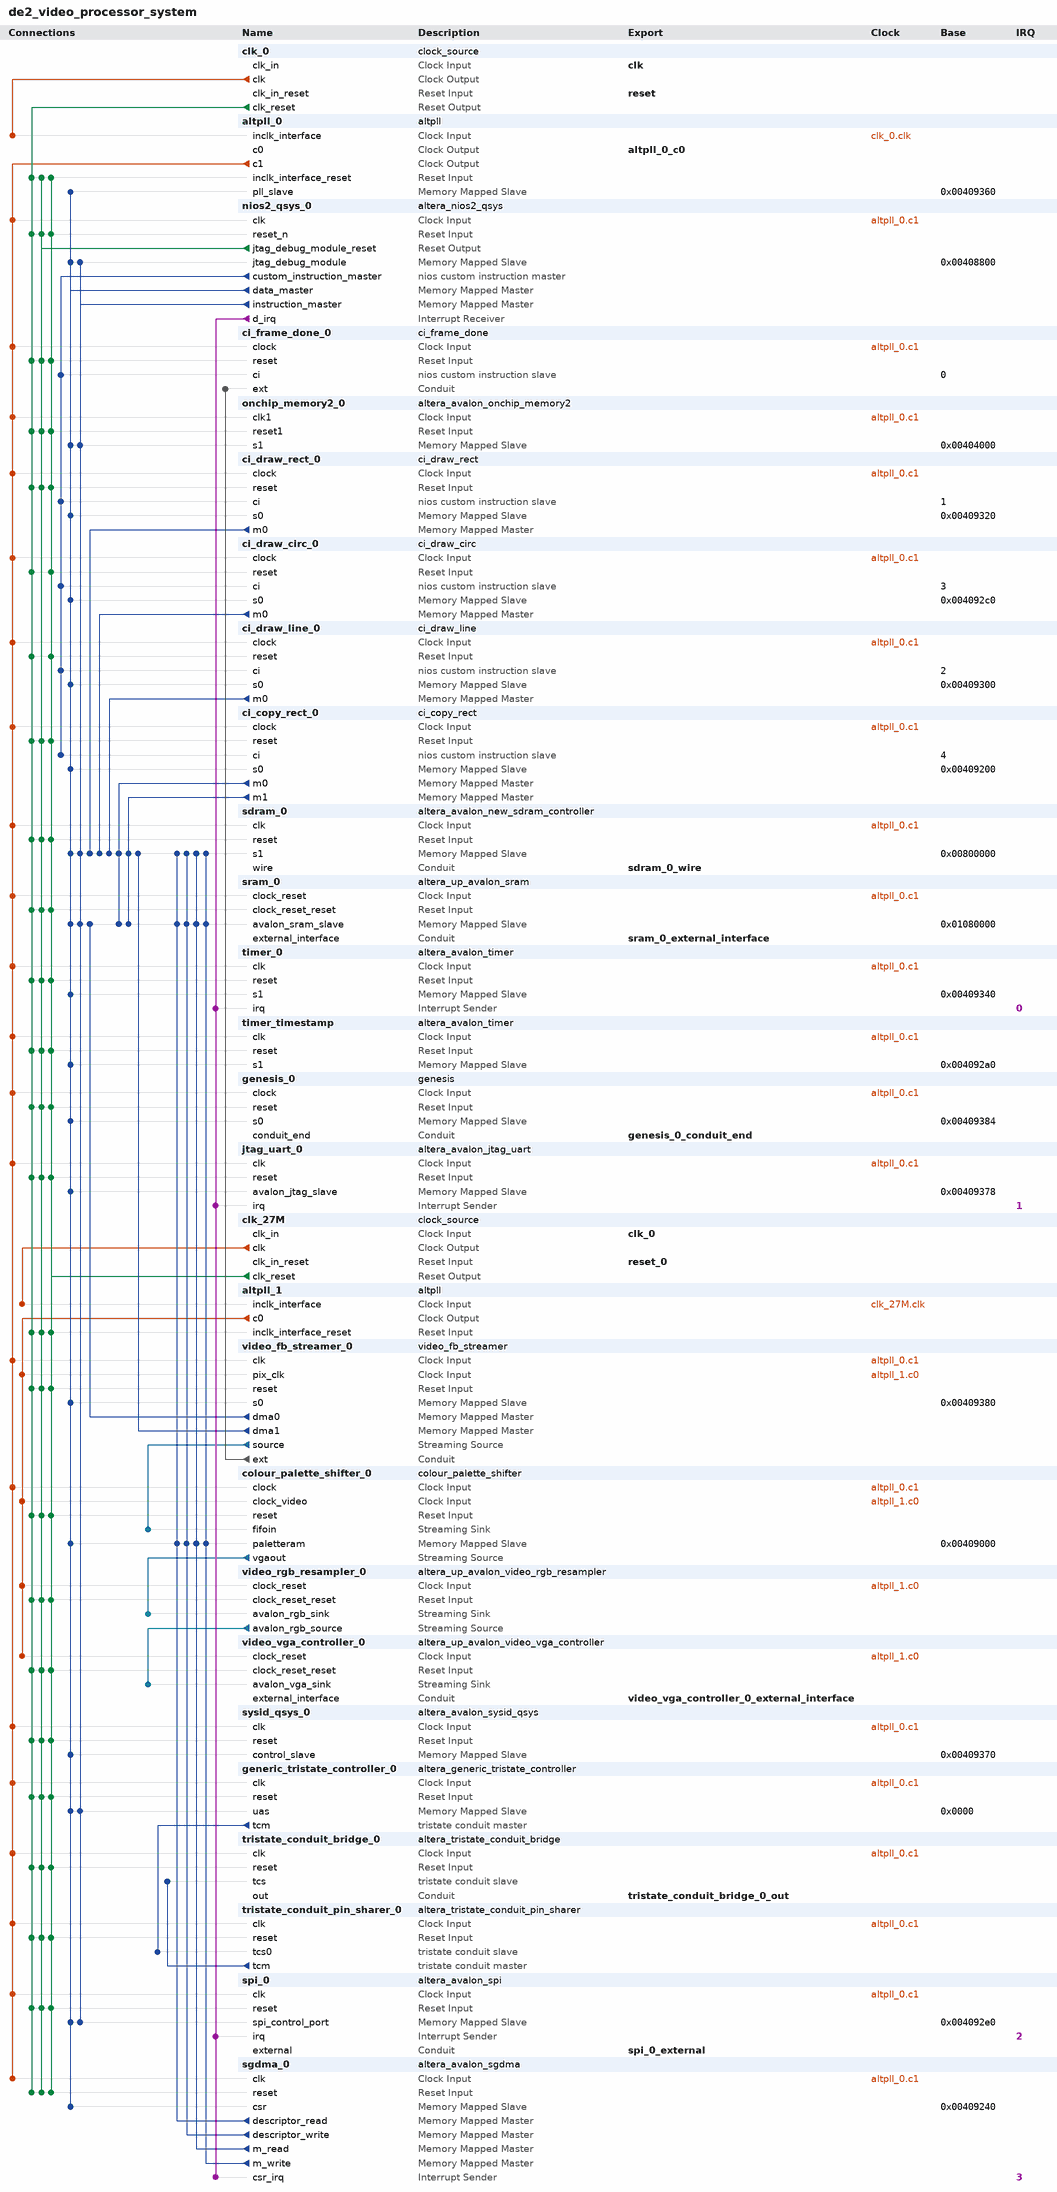
[diagram p0: system contents]
# Platform Designer (Qsys) system de2_video_processor_system, Cyclone II EP2C35F672C6
# Parameters at their usual value, and those the tool derives, are not listed.
package require -exact qsys 12.1
create_system de2_video_processor_system
set_project_property DEVICE_FAMILY {Cyclone II}
set_project_property DEVICE EP2C35F672C6

add_instance clk_0 clock_source 12.1
set_instance_parameter_value clk_0 clockFrequency 50000000

add_instance altpll_0 altpll 12.1
set_instance_parameter_value altpll_0 INCLK0_INPUT_FREQUENCY 20000
set_instance_parameter_value altpll_0 GATE_LOCK_SIGNAL NO
set_instance_parameter_value altpll_0 VALID_LOCK_MULTIPLIER 1
set_instance_parameter_value altpll_0 INVALID_LOCK_MULTIPLIER 5
set_instance_parameter_value altpll_0 CLK0_MULTIPLY_BY 3
set_instance_parameter_value altpll_0 CLK1_MULTIPLY_BY 3
set_instance_parameter_value altpll_0 CLK2_MULTIPLY_BY 1
set_instance_parameter_value altpll_0 CLK0_DIVIDE_BY 2
set_instance_parameter_value altpll_0 CLK1_DIVIDE_BY 2
set_instance_parameter_value altpll_0 CLK2_DIVIDE_BY 2
set_instance_parameter_value altpll_0 CLK0_PHASE_SHIFT -3000
set_instance_parameter_value altpll_0 CLK1_PHASE_SHIFT 0
set_instance_parameter_value altpll_0 CLK2_PHASE_SHIFT 0
set_instance_parameter_value altpll_0 CLK1_DUTY_CYCLE 50
set_instance_parameter_value altpll_0 CLK2_DUTY_CYCLE 50
set_instance_parameter_value altpll_0 PORT_clk1 PORT_USED
set_instance_parameter_value altpll_0 PORT_clk2 PORT_USED
set_instance_parameter_value altpll_0 PORT_clk3 PORT_UNUSED
set_instance_parameter_value altpll_0 PORT_ARESET PORT_UNUSED
set_instance_parameter_value altpll_0 PORT_LOCKED PORT_UNUSED

add_instance nios2_qsys_0 altera_nios2_qsys 12.1
set_instance_parameter_value nios2_qsys_0 muldiv_divider true
set_instance_parameter_value nios2_qsys_0 resetSlave generic_tristate_controller_0.uas
set_instance_parameter_value nios2_qsys_0 exceptionSlave onchip_memory2_0.s1
set_instance_parameter_value nios2_qsys_0 breakSlave nios2_qsys_0.jtag_debug_module
set_instance_parameter_value nios2_qsys_0 impl Small
set_instance_parameter_value nios2_qsys_0 icache_size 1024
set_instance_parameter_value nios2_qsys_0 icache_burstType Sequential

add_instance ci_frame_done_0 ci_frame_done 1.0

add_instance onchip_memory2_0 altera_avalon_onchip_memory2 12.1
set_instance_parameter_value onchip_memory2_0 dataWidth 32
set_instance_parameter_value onchip_memory2_0 dualPort false
set_instance_parameter_value onchip_memory2_0 initMemContent true
set_instance_parameter_value onchip_memory2_0 initializationFileName onchip_memory2_0
set_instance_parameter_value onchip_memory2_0 memorySize 16384

add_instance ci_draw_rect_0 ci_draw_rect 1.0

add_instance ci_draw_circ_0 ci_draw_circ 1.0

add_instance ci_draw_line_0 ci_draw_line 1.0

add_instance ci_copy_rect_0 ci_copy_rect 1.0

add_instance sdram_0 altera_avalon_new_sdram_controller 12.1
set_instance_parameter_value sdram_0 TAC 5.5
set_instance_parameter_value sdram_0 TRCD 20.0
set_instance_parameter_value sdram_0 TRP 20.0
set_instance_parameter_value sdram_0 casLatency 3
set_instance_parameter_value sdram_0 columnWidth 8
set_instance_parameter_value sdram_0 dataWidth 16
set_instance_parameter_value sdram_0 generateSimulationModel false
set_instance_parameter_value sdram_0 model custom
set_instance_parameter_value sdram_0 numberOfBanks 4
set_instance_parameter_value sdram_0 numberOfChipSelects 1
set_instance_parameter_value sdram_0 powerUpDelay 100.0
set_instance_parameter_value sdram_0 refreshPeriod 15.625
set_instance_parameter_value sdram_0 rowWidth 12

add_instance sram_0 altera_up_avalon_sram 12.0
set_instance_parameter_value sram_0 board DE2
set_instance_parameter_value sram_0 pixel_buffer false

add_instance timer_0 altera_avalon_timer 12.1
set_instance_parameter_value timer_0 period 1
set_instance_parameter_value timer_0 periodUnits MSEC
set_instance_parameter_value timer_0 timerPreset CUSTOM

add_instance timer_timestamp altera_avalon_timer 12.1
set_instance_parameter_value timer_timestamp period 1
set_instance_parameter_value timer_timestamp periodUnits MSEC
set_instance_parameter_value timer_timestamp timerPreset CUSTOM

add_instance genesis_0 genesis 1.0

add_instance jtag_uart_0 altera_avalon_jtag_uart 12.1
set_instance_parameter_value jtag_uart_0 simInteractiveOptions INTERACTIVE_INPUT_OUTPUT

add_instance clk_27M clock_source 12.1
set_instance_parameter_value clk_27M clockFrequency 27000000

add_instance altpll_1 altpll 12.1
set_instance_parameter_value altpll_1 INCLK0_INPUT_FREQUENCY 37037
set_instance_parameter_value altpll_1 GATE_LOCK_SIGNAL NO
set_instance_parameter_value altpll_1 VALID_LOCK_MULTIPLIER 1
set_instance_parameter_value altpll_1 INVALID_LOCK_MULTIPLIER 5
set_instance_parameter_value altpll_1 CLK0_MULTIPLY_BY 1007
set_instance_parameter_value altpll_1 CLK0_DIVIDE_BY 1080
set_instance_parameter_value altpll_1 PORT_clk1 PORT_UNUSED
set_instance_parameter_value altpll_1 PORT_clk2 PORT_UNUSED
set_instance_parameter_value altpll_1 PORT_clk3 PORT_UNUSED
set_instance_parameter_value altpll_1 PORT_ARESET PORT_USED
set_instance_parameter_value altpll_1 PORT_LOCKED PORT_USED

add_instance video_fb_streamer_0 video_fb_streamer 1.0
set_instance_parameter_value video_fb_streamer_0 SRAM_BUF_START_ADDRESS 17301504
set_instance_parameter_value video_fb_streamer_0 BITS_PER_PIXEL 8
set_instance_parameter_value video_fb_streamer_0 FRAME_WIDTH 640
set_instance_parameter_value video_fb_streamer_0 FRAME_HEIGHT 480

add_instance colour_palette_shifter_0 colour_palette_shifter 1.0
set_instance_parameter_value colour_palette_shifter_0 VGA_INPUT_STREAM_WIDTH 8
set_instance_parameter_value colour_palette_shifter_0 VGA_OUTPUT_STREAM_WIDTH 16

add_instance video_rgb_resampler_0 altera_up_avalon_video_rgb_resampler 12.0
set_instance_parameter_value video_rgb_resampler_0 input_type {16-bit RGB}
set_instance_parameter_value video_rgb_resampler_0 output_type {30-bit RGB}
set_instance_parameter_value video_rgb_resampler_0 alpha 1023

add_instance video_vga_controller_0 altera_up_avalon_video_vga_controller 12.0
set_instance_parameter_value video_vga_controller_0 board DE2

add_instance sysid_qsys_0 altera_avalon_sysid_qsys 12.1
set_instance_parameter_value sysid_qsys_0 id 1335541401

add_instance generic_tristate_controller_0 altera_generic_tristate_controller 12.1
set_instance_parameter_value generic_tristate_controller_0 TCM_ADDRESS_W 22
set_instance_parameter_value generic_tristate_controller_0 TCM_DATA_W 8
set_instance_parameter_value generic_tristate_controller_0 TCM_BYTEENABLE_W 1
set_instance_parameter_value generic_tristate_controller_0 TCM_READ_WAIT 160
set_instance_parameter_value generic_tristate_controller_0 TCM_WRITE_WAIT 160
set_instance_parameter_value generic_tristate_controller_0 TCM_SETUP_WAIT 40
set_instance_parameter_value generic_tristate_controller_0 TCM_DATA_HOLD 40
set_instance_parameter_value generic_tristate_controller_0 TCM_MAX_PENDING_READ_TRANSACTIONS 3
set_instance_parameter_value generic_tristate_controller_0 TCM_TURNAROUND_TIME 2
set_instance_parameter_value generic_tristate_controller_0 TCM_TIMING_UNITS 0
set_instance_parameter_value generic_tristate_controller_0 TCM_READLATENCY 2
set_instance_parameter_value generic_tristate_controller_0 TCM_SYMBOLS_PER_WORD 1
set_instance_parameter_value generic_tristate_controller_0 USE_READ 1
set_instance_parameter_value generic_tristate_controller_0 USE_BEGINTRANSFER 0
set_instance_parameter_value generic_tristate_controller_0 USE_BYTEENABLE 0
set_instance_parameter_value generic_tristate_controller_0 USE_OUTPUTENABLE 0
set_instance_parameter_value generic_tristate_controller_0 ACTIVE_LOW_READ 1
set_instance_parameter_value generic_tristate_controller_0 ACTIVE_LOW_BYTEENABLE 0
set_instance_parameter_value generic_tristate_controller_0 ACTIVE_LOW_OUTPUTENABLE 0
set_instance_parameter_value generic_tristate_controller_0 ACTIVE_LOW_BEGINTRANSFER 0
set_instance_parameter_value generic_tristate_controller_0 CHIPSELECT_THROUGH_READLATENCY 0
set_instance_parameter_value generic_tristate_controller_0 MODULE_ASSIGNMENT_KEYS embeddedsw.configuration.hwClassnameDriverSupportList,embeddedsw.configuration.isFlash,embeddedsw.configuration.isMemoryDevice,embeddedsw.configuration.isNonVolatileStorage
set_instance_parameter_value generic_tristate_controller_0 MODULE_ASSIGNMENT_VALUES "altera_avalon_lan91c111\\,altera_avalon_cfi_flash,1,1,1"
set_instance_parameter_value generic_tristate_controller_0 INTERFACE_ASSIGNMENT_KEYS embeddedsw.configuration.isFlash,embeddedsw.configuration.isMemoryDevice,embeddedsw.configuration.isNonVolatileStorage
set_instance_parameter_value generic_tristate_controller_0 INTERFACE_ASSIGNMENT_VALUES 1,1,1

add_instance tristate_conduit_bridge_0 altera_tristate_conduit_bridge 12.1

add_instance tristate_conduit_pin_sharer_0 altera_tristate_conduit_pin_sharer 12.1
set_instance_parameter_value tristate_conduit_pin_sharer_0 NUM_INTERFACES 1
set_instance_parameter_value tristate_conduit_pin_sharer_0 MODULE_ORIGIN_LIST generic_tristate_controller_0.tcm,generic_tristate_controller_0.tcm,generic_tristate_controller_0.tcm,generic_tristate_controller_0.tcm,generic_tristate_controller_0.tcm

add_instance spi_0 altera_avalon_spi 12.1
set_instance_parameter_value spi_0 clockPolarity 0
set_instance_parameter_value spi_0 dataWidth 8
set_instance_parameter_value spi_0 masterSPI true
set_instance_parameter_value spi_0 numberOfSlaves 1
set_instance_parameter_value spi_0 targetClockRate 25000000

add_instance sgdma_0 altera_avalon_sgdma 12.1
set_instance_parameter_value sgdma_0 enableBurstTransfers false
set_instance_parameter_value sgdma_0 enableUnalignedTransfers true
set_instance_parameter_value sgdma_0 readBlockDataWidth 32
set_instance_parameter_value sgdma_0 sinkErrorWidth 0
set_instance_parameter_value sgdma_0 sourceErrorWidth 0
set_instance_parameter_value sgdma_0 transferMode MEMORY_TO_MEMORY
set_instance_parameter_value sgdma_0 writeBurstcountWidth 4

# connections
add_connection altpll_0.c1 ci_copy_rect_0.clock clock
add_connection altpll_0.c1 ci_draw_circ_0.clock clock
add_connection altpll_0.c1 ci_draw_line_0.clock clock
add_connection altpll_0.c1 ci_draw_rect_0.clock clock
add_connection altpll_0.c1 ci_frame_done_0.clock clock
add_connection altpll_0.c1 colour_palette_shifter_0.clock clock
add_connection altpll_0.c1 generic_tristate_controller_0.clk clock
add_connection altpll_0.c1 genesis_0.clock clock
add_connection altpll_0.c1 jtag_uart_0.clk clock
add_connection altpll_0.c1 nios2_qsys_0.clk clock
add_connection altpll_0.c1 onchip_memory2_0.clk1 clock
add_connection altpll_0.c1 sdram_0.clk clock
add_connection altpll_0.c1 sgdma_0.clk clock
add_connection altpll_0.c1 spi_0.clk clock
add_connection altpll_0.c1 sram_0.clock_reset clock
add_connection altpll_0.c1 sysid_qsys_0.clk clock
add_connection altpll_0.c1 timer_0.clk clock
add_connection altpll_0.c1 timer_timestamp.clk clock
add_connection altpll_0.c1 tristate_conduit_bridge_0.clk clock
add_connection altpll_0.c1 tristate_conduit_pin_sharer_0.clk clock
add_connection altpll_0.c1 video_fb_streamer_0.clk clock
add_connection altpll_1.c0 colour_palette_shifter_0.clock_video clock
add_connection altpll_1.c0 video_fb_streamer_0.pix_clk clock
add_connection altpll_1.c0 video_rgb_resampler_0.clock_reset clock
add_connection altpll_1.c0 video_vga_controller_0.clock_reset clock
add_connection clk_0.clk altpll_0.inclk_interface clock
add_connection clk_27M.clk altpll_1.inclk_interface clock
add_connection clk_0.clk_reset altpll_0.inclk_interface_reset reset
add_connection clk_0.clk_reset altpll_1.inclk_interface_reset reset
add_connection clk_0.clk_reset ci_copy_rect_0.reset reset
add_connection clk_0.clk_reset ci_draw_circ_0.reset reset
add_connection clk_0.clk_reset ci_draw_line_0.reset reset
add_connection clk_0.clk_reset ci_draw_rect_0.reset reset
add_connection clk_0.clk_reset ci_frame_done_0.reset reset
add_connection clk_0.clk_reset colour_palette_shifter_0.reset reset
add_connection clk_0.clk_reset generic_tristate_controller_0.reset reset
add_connection clk_0.clk_reset genesis_0.reset reset
add_connection clk_0.clk_reset jtag_uart_0.reset reset
add_connection clk_0.clk_reset nios2_qsys_0.reset_n reset
add_connection clk_0.clk_reset onchip_memory2_0.reset1 reset
add_connection clk_0.clk_reset sdram_0.reset reset
add_connection clk_0.clk_reset sgdma_0.reset reset
add_connection clk_0.clk_reset spi_0.reset reset
add_connection clk_0.clk_reset sram_0.clock_reset_reset reset
add_connection clk_0.clk_reset sysid_qsys_0.reset reset
add_connection clk_0.clk_reset timer_0.reset reset
add_connection clk_0.clk_reset timer_timestamp.reset reset
add_connection clk_0.clk_reset tristate_conduit_bridge_0.reset reset
add_connection clk_0.clk_reset tristate_conduit_pin_sharer_0.reset reset
add_connection clk_0.clk_reset video_fb_streamer_0.reset reset
add_connection clk_0.clk_reset video_rgb_resampler_0.clock_reset_reset reset
add_connection clk_0.clk_reset video_vga_controller_0.clock_reset_reset reset
add_connection clk_27M.clk_reset altpll_0.inclk_interface_reset reset
add_connection clk_27M.clk_reset altpll_1.inclk_interface_reset reset
add_connection clk_27M.clk_reset ci_copy_rect_0.reset reset
add_connection clk_27M.clk_reset ci_draw_circ_0.reset reset
add_connection clk_27M.clk_reset ci_draw_line_0.reset reset
add_connection clk_27M.clk_reset ci_draw_rect_0.reset reset
add_connection clk_27M.clk_reset ci_frame_done_0.reset reset
add_connection clk_27M.clk_reset colour_palette_shifter_0.reset reset
add_connection clk_27M.clk_reset generic_tristate_controller_0.reset reset
add_connection clk_27M.clk_reset genesis_0.reset reset
add_connection clk_27M.clk_reset jtag_uart_0.reset reset
add_connection clk_27M.clk_reset nios2_qsys_0.reset_n reset
add_connection clk_27M.clk_reset onchip_memory2_0.reset1 reset
add_connection clk_27M.clk_reset sdram_0.reset reset
add_connection clk_27M.clk_reset sgdma_0.reset reset
add_connection clk_27M.clk_reset spi_0.reset reset
add_connection clk_27M.clk_reset sram_0.clock_reset_reset reset
add_connection clk_27M.clk_reset sysid_qsys_0.reset reset
add_connection clk_27M.clk_reset timer_0.reset reset
add_connection clk_27M.clk_reset timer_timestamp.reset reset
add_connection clk_27M.clk_reset tristate_conduit_bridge_0.reset reset
add_connection clk_27M.clk_reset tristate_conduit_pin_sharer_0.reset reset
add_connection clk_27M.clk_reset video_fb_streamer_0.reset reset
add_connection clk_27M.clk_reset video_rgb_resampler_0.clock_reset_reset reset
add_connection clk_27M.clk_reset video_vga_controller_0.clock_reset_reset reset
add_connection nios2_qsys_0.jtag_debug_module_reset altpll_0.inclk_interface_reset reset
add_connection nios2_qsys_0.jtag_debug_module_reset altpll_1.inclk_interface_reset reset
add_connection nios2_qsys_0.jtag_debug_module_reset ci_copy_rect_0.reset reset
add_connection nios2_qsys_0.jtag_debug_module_reset ci_draw_rect_0.reset reset
add_connection nios2_qsys_0.jtag_debug_module_reset ci_frame_done_0.reset reset
add_connection nios2_qsys_0.jtag_debug_module_reset colour_palette_shifter_0.reset reset
add_connection nios2_qsys_0.jtag_debug_module_reset generic_tristate_controller_0.reset reset
add_connection nios2_qsys_0.jtag_debug_module_reset genesis_0.reset reset
add_connection nios2_qsys_0.jtag_debug_module_reset jtag_uart_0.reset reset
add_connection nios2_qsys_0.jtag_debug_module_reset nios2_qsys_0.reset_n reset
add_connection nios2_qsys_0.jtag_debug_module_reset onchip_memory2_0.reset1 reset
add_connection nios2_qsys_0.jtag_debug_module_reset sdram_0.reset reset
add_connection nios2_qsys_0.jtag_debug_module_reset sgdma_0.reset reset
add_connection nios2_qsys_0.jtag_debug_module_reset spi_0.reset reset
add_connection nios2_qsys_0.jtag_debug_module_reset sram_0.clock_reset_reset reset
add_connection nios2_qsys_0.jtag_debug_module_reset sysid_qsys_0.reset reset
add_connection nios2_qsys_0.jtag_debug_module_reset timer_0.reset reset
add_connection nios2_qsys_0.jtag_debug_module_reset timer_timestamp.reset reset
add_connection nios2_qsys_0.jtag_debug_module_reset tristate_conduit_bridge_0.reset reset
add_connection nios2_qsys_0.jtag_debug_module_reset tristate_conduit_pin_sharer_0.reset reset
add_connection nios2_qsys_0.jtag_debug_module_reset video_fb_streamer_0.reset reset
add_connection nios2_qsys_0.jtag_debug_module_reset video_rgb_resampler_0.clock_reset_reset reset
add_connection nios2_qsys_0.jtag_debug_module_reset video_vga_controller_0.clock_reset_reset reset
add_connection ci_copy_rect_0.m0 sdram_0.s1 avalon
set_connection_parameter_value ci_copy_rect_0.m0/sdram_0.s1 baseAddress 0x00800000
add_connection ci_copy_rect_0.m0 sram_0.avalon_sram_slave avalon
set_connection_parameter_value ci_copy_rect_0.m0/sram_0.avalon_sram_slave baseAddress 0x01080000
add_connection ci_copy_rect_0.m1 sdram_0.s1 avalon
set_connection_parameter_value ci_copy_rect_0.m1/sdram_0.s1 baseAddress 0x00800000
add_connection ci_copy_rect_0.m1 sram_0.avalon_sram_slave avalon
set_connection_parameter_value ci_copy_rect_0.m1/sram_0.avalon_sram_slave baseAddress 0x01080000
add_connection ci_draw_circ_0.m0 sdram_0.s1 avalon
set_connection_parameter_value ci_draw_circ_0.m0/sdram_0.s1 baseAddress 0x00800000
add_connection ci_draw_line_0.m0 sdram_0.s1 avalon
set_connection_parameter_value ci_draw_line_0.m0/sdram_0.s1 baseAddress 0x00800000
add_connection ci_draw_rect_0.m0 sdram_0.s1 avalon
set_connection_parameter_value ci_draw_rect_0.m0/sdram_0.s1 baseAddress 0x00800000
add_connection nios2_qsys_0.data_master altpll_0.pll_slave avalon
set_connection_parameter_value nios2_qsys_0.data_master/altpll_0.pll_slave baseAddress 0x00409360
add_connection nios2_qsys_0.data_master ci_copy_rect_0.s0 avalon
set_connection_parameter_value nios2_qsys_0.data_master/ci_copy_rect_0.s0 baseAddress 0x00409200
add_connection nios2_qsys_0.data_master ci_draw_circ_0.s0 avalon
set_connection_parameter_value nios2_qsys_0.data_master/ci_draw_circ_0.s0 baseAddress 0x004092c0
add_connection nios2_qsys_0.data_master ci_draw_line_0.s0 avalon
set_connection_parameter_value nios2_qsys_0.data_master/ci_draw_line_0.s0 baseAddress 0x00409300
add_connection nios2_qsys_0.data_master ci_draw_rect_0.s0 avalon
set_connection_parameter_value nios2_qsys_0.data_master/ci_draw_rect_0.s0 baseAddress 0x00409320
add_connection nios2_qsys_0.data_master colour_palette_shifter_0.paletteram avalon
set_connection_parameter_value nios2_qsys_0.data_master/colour_palette_shifter_0.paletteram baseAddress 0x00409000
add_connection nios2_qsys_0.data_master generic_tristate_controller_0.uas avalon
set_connection_parameter_value nios2_qsys_0.data_master/generic_tristate_controller_0.uas baseAddress 0x0000
add_connection nios2_qsys_0.data_master genesis_0.s0 avalon
set_connection_parameter_value nios2_qsys_0.data_master/genesis_0.s0 baseAddress 0x00409384
add_connection nios2_qsys_0.data_master jtag_uart_0.avalon_jtag_slave avalon
set_connection_parameter_value nios2_qsys_0.data_master/jtag_uart_0.avalon_jtag_slave baseAddress 0x00409378
add_connection nios2_qsys_0.data_master nios2_qsys_0.jtag_debug_module avalon
set_connection_parameter_value nios2_qsys_0.data_master/nios2_qsys_0.jtag_debug_module baseAddress 0x00408800
add_connection nios2_qsys_0.data_master onchip_memory2_0.s1 avalon
set_connection_parameter_value nios2_qsys_0.data_master/onchip_memory2_0.s1 baseAddress 0x00404000
add_connection nios2_qsys_0.data_master sdram_0.s1 avalon
set_connection_parameter_value nios2_qsys_0.data_master/sdram_0.s1 baseAddress 0x00800000
add_connection nios2_qsys_0.data_master sgdma_0.csr avalon
set_connection_parameter_value nios2_qsys_0.data_master/sgdma_0.csr baseAddress 0x00409240
add_connection nios2_qsys_0.data_master spi_0.spi_control_port avalon
set_connection_parameter_value nios2_qsys_0.data_master/spi_0.spi_control_port baseAddress 0x004092e0
add_connection nios2_qsys_0.data_master sram_0.avalon_sram_slave avalon
set_connection_parameter_value nios2_qsys_0.data_master/sram_0.avalon_sram_slave baseAddress 0x01080000
add_connection nios2_qsys_0.data_master sysid_qsys_0.control_slave avalon
set_connection_parameter_value nios2_qsys_0.data_master/sysid_qsys_0.control_slave baseAddress 0x00409370
add_connection nios2_qsys_0.data_master timer_0.s1 avalon
set_connection_parameter_value nios2_qsys_0.data_master/timer_0.s1 baseAddress 0x00409340
add_connection nios2_qsys_0.data_master timer_timestamp.s1 avalon
set_connection_parameter_value nios2_qsys_0.data_master/timer_timestamp.s1 baseAddress 0x004092a0
add_connection nios2_qsys_0.data_master video_fb_streamer_0.s0 avalon
set_connection_parameter_value nios2_qsys_0.data_master/video_fb_streamer_0.s0 baseAddress 0x00409380
add_connection nios2_qsys_0.instruction_master generic_tristate_controller_0.uas avalon
set_connection_parameter_value nios2_qsys_0.instruction_master/generic_tristate_controller_0.uas baseAddress 0x0000
add_connection nios2_qsys_0.instruction_master nios2_qsys_0.jtag_debug_module avalon
set_connection_parameter_value nios2_qsys_0.instruction_master/nios2_qsys_0.jtag_debug_module baseAddress 0x00408800
add_connection nios2_qsys_0.instruction_master onchip_memory2_0.s1 avalon
set_connection_parameter_value nios2_qsys_0.instruction_master/onchip_memory2_0.s1 baseAddress 0x00404000
add_connection nios2_qsys_0.instruction_master sdram_0.s1 avalon
set_connection_parameter_value nios2_qsys_0.instruction_master/sdram_0.s1 baseAddress 0x00800000
add_connection nios2_qsys_0.instruction_master spi_0.spi_control_port avalon
set_connection_parameter_value nios2_qsys_0.instruction_master/spi_0.spi_control_port baseAddress 0x004092e0
add_connection nios2_qsys_0.instruction_master sram_0.avalon_sram_slave avalon
set_connection_parameter_value nios2_qsys_0.instruction_master/sram_0.avalon_sram_slave baseAddress 0x01080000
add_connection sgdma_0.descriptor_read colour_palette_shifter_0.paletteram avalon
set_connection_parameter_value sgdma_0.descriptor_read/colour_palette_shifter_0.paletteram baseAddress 0x00409000
add_connection sgdma_0.descriptor_read sdram_0.s1 avalon
set_connection_parameter_value sgdma_0.descriptor_read/sdram_0.s1 baseAddress 0x00800000
add_connection sgdma_0.descriptor_read sram_0.avalon_sram_slave avalon
set_connection_parameter_value sgdma_0.descriptor_read/sram_0.avalon_sram_slave baseAddress 0x01080000
add_connection sgdma_0.descriptor_write colour_palette_shifter_0.paletteram avalon
set_connection_parameter_value sgdma_0.descriptor_write/colour_palette_shifter_0.paletteram baseAddress 0x00409000
add_connection sgdma_0.descriptor_write sdram_0.s1 avalon
set_connection_parameter_value sgdma_0.descriptor_write/sdram_0.s1 baseAddress 0x00800000
add_connection sgdma_0.descriptor_write sram_0.avalon_sram_slave avalon
set_connection_parameter_value sgdma_0.descriptor_write/sram_0.avalon_sram_slave baseAddress 0x01080000
add_connection sgdma_0.m_read colour_palette_shifter_0.paletteram avalon
set_connection_parameter_value sgdma_0.m_read/colour_palette_shifter_0.paletteram baseAddress 0x00409000
add_connection sgdma_0.m_read sdram_0.s1 avalon
set_connection_parameter_value sgdma_0.m_read/sdram_0.s1 baseAddress 0x00800000
add_connection sgdma_0.m_read sram_0.avalon_sram_slave avalon
set_connection_parameter_value sgdma_0.m_read/sram_0.avalon_sram_slave baseAddress 0x01080000
add_connection sgdma_0.m_write colour_palette_shifter_0.paletteram avalon
set_connection_parameter_value sgdma_0.m_write/colour_palette_shifter_0.paletteram baseAddress 0x00409000
add_connection sgdma_0.m_write sdram_0.s1 avalon
set_connection_parameter_value sgdma_0.m_write/sdram_0.s1 baseAddress 0x00800000
add_connection sgdma_0.m_write sram_0.avalon_sram_slave avalon
set_connection_parameter_value sgdma_0.m_write/sram_0.avalon_sram_slave baseAddress 0x01080000
add_connection video_fb_streamer_0.dma0 sram_0.avalon_sram_slave avalon
set_connection_parameter_value video_fb_streamer_0.dma0/sram_0.avalon_sram_slave baseAddress 0x01080000
add_connection video_fb_streamer_0.dma1 sdram_0.s1 avalon
set_connection_parameter_value video_fb_streamer_0.dma1/sdram_0.s1 baseAddress 0x00800000
add_connection colour_palette_shifter_0.vgaout video_rgb_resampler_0.avalon_rgb_sink avalon_streaming
add_connection video_fb_streamer_0.source colour_palette_shifter_0.fifoin avalon_streaming
add_connection video_rgb_resampler_0.avalon_rgb_source video_vga_controller_0.avalon_vga_sink avalon_streaming
add_connection video_fb_streamer_0.ext ci_frame_done_0.ext conduit
add_connection nios2_qsys_0.d_irq jtag_uart_0.irq interrupt
set_connection_parameter_value nios2_qsys_0.d_irq/jtag_uart_0.irq irqNumber 1
add_connection nios2_qsys_0.d_irq sgdma_0.csr_irq interrupt
set_connection_parameter_value nios2_qsys_0.d_irq/sgdma_0.csr_irq irqNumber 3
add_connection nios2_qsys_0.d_irq spi_0.irq interrupt
set_connection_parameter_value nios2_qsys_0.d_irq/spi_0.irq irqNumber 2
add_connection nios2_qsys_0.d_irq timer_0.irq interrupt
set_connection_parameter_value nios2_qsys_0.d_irq/timer_0.irq irqNumber 0
add_connection nios2_qsys_0.custom_instruction_master ci_copy_rect_0.ci nios_custom_instruction
set_connection_parameter_value nios2_qsys_0.custom_instruction_master/ci_copy_rect_0.ci CIName ci_copy_rect_0
set_connection_parameter_value nios2_qsys_0.custom_instruction_master/ci_copy_rect_0.ci baseAddress 4
add_connection nios2_qsys_0.custom_instruction_master ci_draw_circ_0.ci nios_custom_instruction
set_connection_parameter_value nios2_qsys_0.custom_instruction_master/ci_draw_circ_0.ci CIName ci_draw_circ_0
set_connection_parameter_value nios2_qsys_0.custom_instruction_master/ci_draw_circ_0.ci baseAddress 3
add_connection nios2_qsys_0.custom_instruction_master ci_draw_line_0.ci nios_custom_instruction
set_connection_parameter_value nios2_qsys_0.custom_instruction_master/ci_draw_line_0.ci CIName ci_draw_line_0
set_connection_parameter_value nios2_qsys_0.custom_instruction_master/ci_draw_line_0.ci baseAddress 2
add_connection nios2_qsys_0.custom_instruction_master ci_draw_rect_0.ci nios_custom_instruction
set_connection_parameter_value nios2_qsys_0.custom_instruction_master/ci_draw_rect_0.ci CIName ci_draw_rect_0
set_connection_parameter_value nios2_qsys_0.custom_instruction_master/ci_draw_rect_0.ci baseAddress 1
add_connection nios2_qsys_0.custom_instruction_master ci_frame_done_0.ci nios_custom_instruction
set_connection_parameter_value nios2_qsys_0.custom_instruction_master/ci_frame_done_0.ci CIName ci_frame_done_0
set_connection_parameter_value nios2_qsys_0.custom_instruction_master/ci_frame_done_0.ci baseAddress 0
add_connection generic_tristate_controller_0.tcm tristate_conduit_pin_sharer_0.tcs0 tristate_conduit
add_connection tristate_conduit_pin_sharer_0.tcm tristate_conduit_bridge_0.tcs tristate_conduit

# exported interfaces
add_interface clk clock sink
set_interface_property clk EXPORT_OF clk_0.clk_in
add_interface reset reset sink
set_interface_property reset EXPORT_OF clk_0.clk_in_reset
add_interface altpll_0_c0 clock source
set_interface_property altpll_0_c0 EXPORT_OF altpll_0.c0
add_interface sdram_0_wire conduit end
set_interface_property sdram_0_wire EXPORT_OF sdram_0.wire
add_interface sram_0_external_interface conduit end
set_interface_property sram_0_external_interface EXPORT_OF sram_0.external_interface
add_interface tristate_conduit_bridge_0_out conduit end
set_interface_property tristate_conduit_bridge_0_out EXPORT_OF tristate_conduit_bridge_0.out
add_interface clk_0 clock sink
set_interface_property clk_0 EXPORT_OF clk_27M.clk_in
add_interface reset_0 reset sink
set_interface_property reset_0 EXPORT_OF clk_27M.clk_in_reset
add_interface video_vga_controller_0_external_interface conduit end
set_interface_property video_vga_controller_0_external_interface EXPORT_OF video_vga_controller_0.external_interface
add_interface genesis_0_conduit_end conduit end
set_interface_property genesis_0_conduit_end EXPORT_OF genesis_0.conduit_end
add_interface spi_0_external conduit end
set_interface_property spi_0_external EXPORT_OF spi_0.external

save_system de2_video_processor_system.qsys
